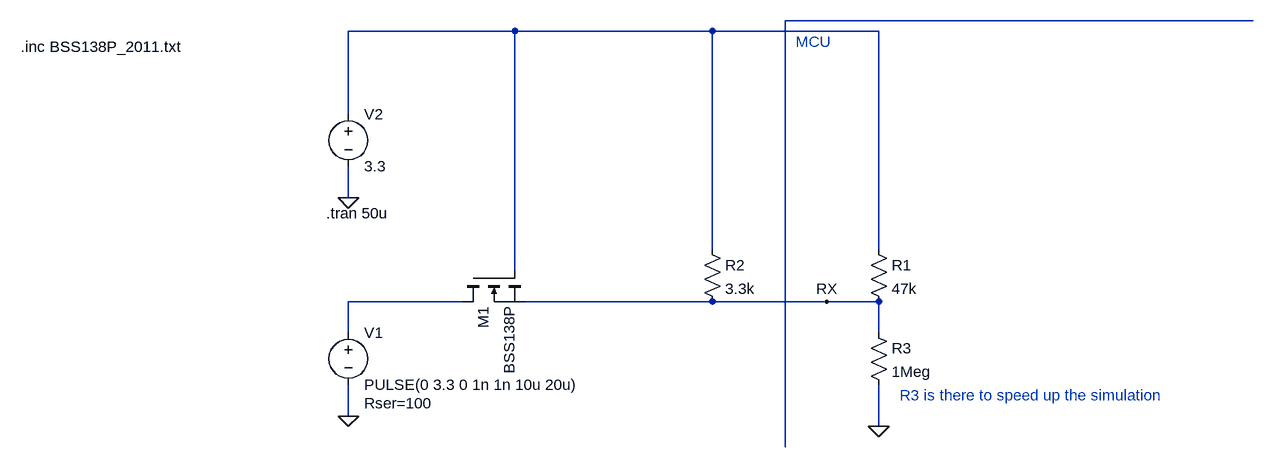
[diagram p0: schematic bss138_level_shifter.asc]
bss138_level_shifter.asc, the LTspice schematic file:
Version 4
SHEET 1 1300 680
WIRE 1296 -288 576 -288
WIRE 160 -272 -96 -272
WIRE 464 -272 160 -272
WIRE 720 -272 464 -272
WIRE -96 -144 -96 -272
WIRE -96 -16 -96 -64
WIRE 464 64 464 -272
WIRE 720 64 720 -272
WIRE 160 96 160 -272
WIRE 80 144 -96 144
WIRE 464 144 176 144
WIRE 640 144 464 144
WIRE 720 144 640 144
WIRE -96 192 -96 144
WIRE 720 192 720 144
WIRE -96 320 -96 272
WIRE 720 336 720 272
WIRE 576 368 576 -288
FLAG -96 -16 0
FLAG -96 320 0
FLAG 720 336 0
FLAG 640 144 RX
SYMBOL nmos 80 96 M90
SYMATTR InstName M1
SYMATTR Value BSS138P
SYMATTR Prefix X
SYMBOL voltage -96 176 R0
WINDOW 123 0 0 Left 0
WINDOW 39 24 124 Left 2
SYMATTR InstName V1
SYMATTR Value PULSE(0 3.3 0 1n 1n 10u 20u)
SYMATTR SpiceLine Rser=100
SYMBOL voltage -96 -160 R0
WINDOW 123 0 0 Left 0
WINDOW 39 0 0 Left 0
SYMATTR InstName V2
SYMATTR Value 3.3
SYMBOL res 704 48 R0
SYMATTR InstName R1
SYMATTR Value 47k
SYMBOL res 448 48 R0
SYMATTR InstName R2
SYMATTR Value 3.3k
SYMBOL res 704 176 R0
SYMATTR InstName R3
SYMATTR Value 1Meg
TEXT -130 8 Left 2 !.tran 50u
TEXT -600 -248 Left 2 !.inc BSS138P_2011.txt
TEXT 592 -256 Left 2 ;MCU
TEXT 752 288 Left 2 ;R3 is there to speed up the simulation

The netlist it stands for:
* bss138_level_shifter.asc
XM1 N003 N002 RX BSS138P  ; pins D G S
V1 N003 0 PULSE(0 3.3 0 1n 1n 10u 20u) Rser=100
V2 N002 0 3.3
R1 N002 RX 47k
R2 N002 RX 3.3k
R3 RX 0 1Meg
.tran 50u
.inc BSS138P_2011.txt
* MCU
* R3 is there to speed up the simulation
.backanno
.end